# Altium schematic sheet power.SchDoc
size A
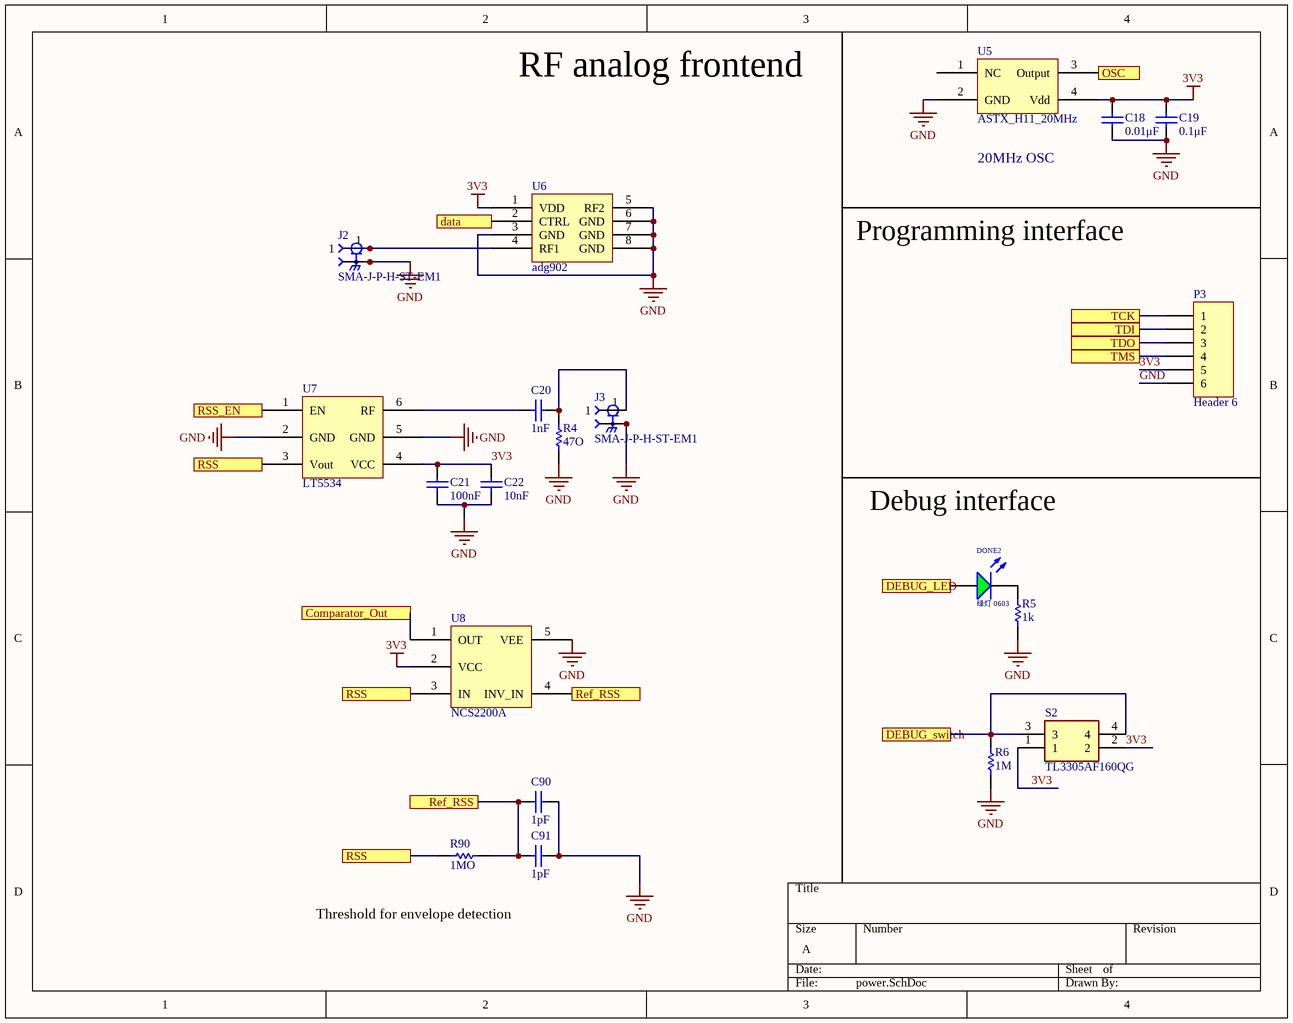
[diagram p0: power.SchDoc]

## Parts
C18  0.01μF  [1608[0603]]
C19  0.1μF  [1608[0603]]
C20  1nF  [1608[0603]]
C21  100nF  [1608[0603]]
C22  10nF  [1608[0603]]
C90  value 1pF  [1608[0603]]  (hidden comment: 1nF)
C91  value 1pF  [1608[0603]]  (hidden comment: 1nF)
DONE2  绿灯 0603  [0603_LED]
J2  SMA-J-P-H-ST-EM1  [SAMTEC_SMA-J-P-H-ST-EM1]
J3  SMA-J-P-H-ST-EM1  [SAMTEC_SMA-J-P-H-ST-EM1]
P3  Header 6  [HDR1X6]
R4  value 47O  [1608[0603]]  (hidden comment: 47 Ohm)
R5  value 1k  [1608[0603]]  (hidden comment: 1k Ohm)
R6  value 1M  [1608[0603]]  (hidden comment: 1k Ohm)
R90  value 1MO  [1608[0603]]  (hidden comment: 47 Ohm)
S2  TL3305AF160QG  [TL3305AF160QG]
U5  ASTX_H11_20MHz  [ASTX_H11]
U6  adg902  [ADG902]
U7  LT5534  [LT5534]
U8  NCS2200A  [NCS2200]

## Ports
Comparator_Out, data, DEBUG_LED, DEBUG_switch, OSC, Ref_RSS, RSS, RSS_EN, TCK, TDI, TDO, TMS

## Nets
3V3: C18.2 C19.2 C21.2 C22.2 P3.5 S2.1 S2.2 U5.4(Vdd) U6.1(VDD) U7.4(VCC) U8.2(VCC)
GND: C18.1 C19.1 C21.1 C22.1 C90.2 C91.2 J2.2_1 J2.2_2 J2.3_1 J2.3_2 J3.2_1 J3.2_2 J3.3_1 J3.3_2 P3.6 R4.1 R5.1 R6.1 U5.2(GND) U6.3(GND) U6.5(RF2) U6.6(GND) U6.7(GND) U6.8(GND) U7.2(GND) U7.5(GND) U8.5(VEE)
Comparator_Out: U8.1(OUT) ; port Comparator_Out
data: U6.2(CTRL) ; port data
DEBUG_LED: DONE2.A ; port DEBUG_LED
DEBUG_switch: R6.2 S2.3 S2.4 ; port DEBUG_switch
OSC: U5.3(Output) ; port OSC
Ref_RSS: C90.1 C91.1 R90.1 U8.4(INV_IN) ; port Ref_RSS
RSS: R90.2 U7.3(Vout) U8.3(IN) ; port RSS
RSS_EN: U7.1(EN) ; port RSS_EN
TCK: P3.1 ; port TCK
TDI: P3.2 ; port TDI
TDO: P3.3 ; port TDO
TMS: P3.4 ; port TMS
NetC20_1: C20.1 U7.6(RF)
NetC20_2: C20.2 J3.1 R4.2
NetDONE2_K: DONE2.K R5.2
NetJ2_1: J2.1 U6.4(RF1)

Not connected (* = marked no-connect by the designer): U5 1(NC)

## Notes on the sheet
- RF analog frontend
- 20MHz OSC
- Programming interface
- Debug interface
- Threshold for envelope detection

## Library data of the parts
C18 = CAP_3: MLCCs; Value: 100pF; Published: 8-Jun-2000; LatestRevisionDate: 17-Jul-2002; LatestRevisionNote: Re-released for DXP Platform.; PackageReference: RAD-0.3; Publisher: Altium Limited; PackageDescription: Radial Cap, Thru-Hole; 2 Leads; 0.3 in Pin Spacing
C19 = CAP_2: MLCCs; Value: 100pF; Published: 8-Jun-2000; LatestRevisionDate: 17-Jul-2002; LatestRevisionNote: Re-released for DXP Platform.; PackageReference: RAD-0.3; Publisher: Altium Limited; PackageDescription: Radial Cap, Thru-Hole; 2 Leads; 0.3 in Pin Spacing
C20-C22 C90 C91 = Cap: Ceramic Capacitor (Surface Mount); Manufacturer: Generic Ceramic Chip Cap (TBD); Digi-Key Part Number: *; Manufacturer Part Number: *; Note: *; Rating: *
  C20: Value: 1nF
  C21: Value: 100nF
  C22: Value: 10nF
DONE2 = 0603 绿灯: 发光二极管; ComponentLink1Description: 供应商链接; ComponentLink1URL: http://www.szlcsc.com/product/details_73152.html; Package: 0603; Supplier: LC; SuppliersPartNumber: C72043
J2 J3 = SMA-J-P-H-ST-EM1: SMA Connector Jack, Female Socket 50Ohm Board Edge, End Launch Solder; MF: Samtec; SnapEDA_Link: https://www.snapeda.com/parts/SMA-J-P-H-ST-EM1/Samtec%20Inc./view-part/134500/?ref=snap; MP: SMA-J-P-H-ST-EM1; Toby_UK-Purchase-URL: https://snapeda.com/shop?store=Toby+UK&id=134500; Value: *; Package: None; Digi-Key_Part_Number: SAM8857-ND
P3 = Header 6: Header, 6-Pin; LatestRevisionDate: 17-Jul-2002; LatestRevisionNote: Re-released for DXP Platform.; Publisher: Altium Limited
R4-R6 R90 = Res: Chip Resistor (Surface Mount); Manufacturer: Generic Chip Res (TBD); Manufacturer Part Number: *; Digi-Key Part Number: *; Rating: *
S2 = TL3305AF160QG: Switch; Manufacturer_Name: E-Switch; Datasheet Link: https://componentsearchengine.com//TL3305AF160QG.pdf; Mouser2 Part Number: 612-TL3305AF160QG; Mouser2 Price/Stock: https://www.mouser.com/Search/Refine.aspx?Keyword=612-TL3305AF160QG; Manufacturer_Part_Number: TL3305AF160QG
U7 = LT55534